# EAGLE schematic MBO (EAGLE 7.4.0)
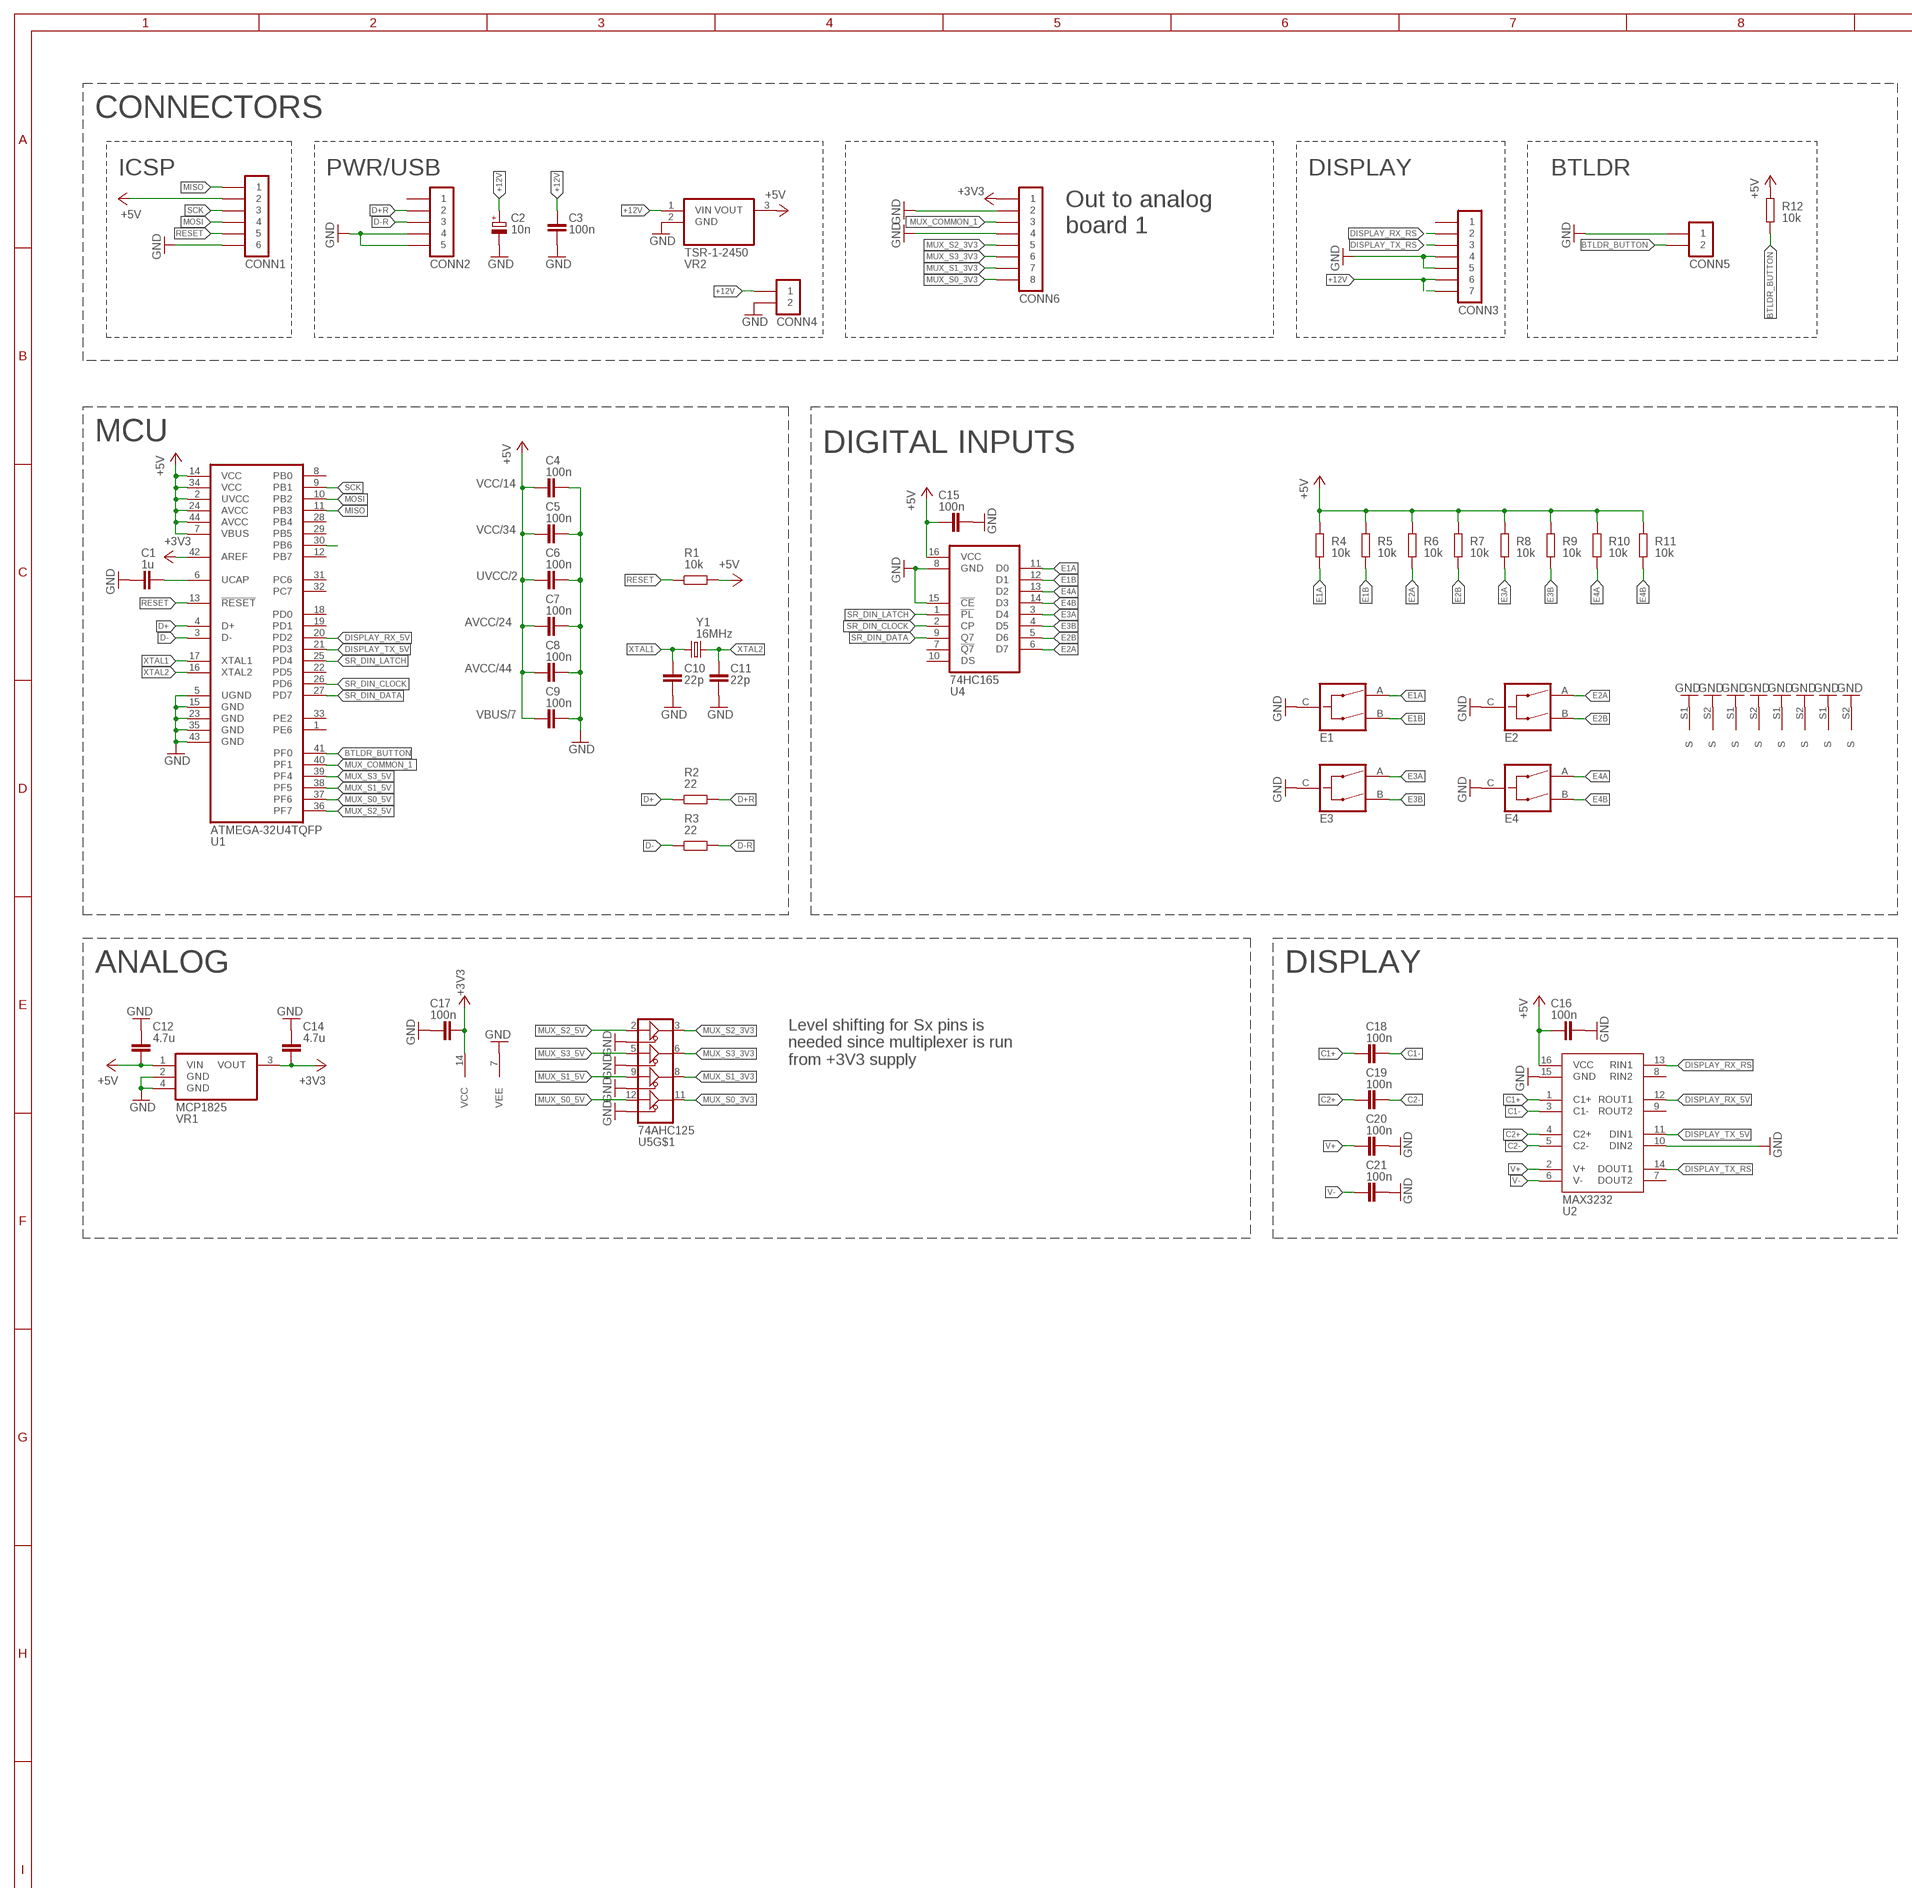
[diagram p0: schematic, sheet 1, part 1 of 2]
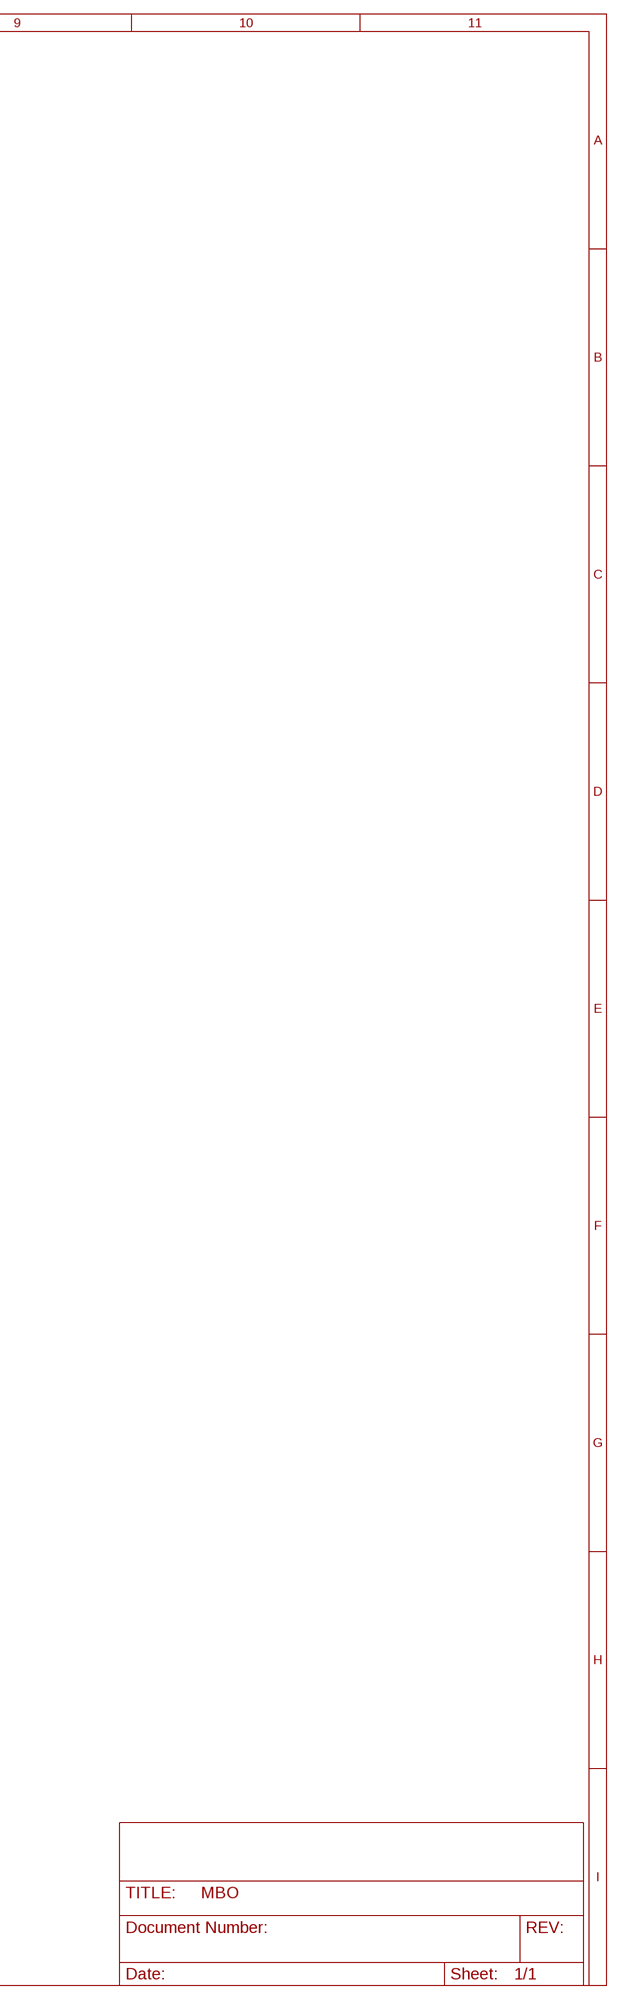
[diagram p1: schematic, sheet 1, part 2 of 2]

## Parts
C1  1u  CAPACITOR-0805  [C0805]
C2  10n  ELECTROLYTIC_CAPACITOR16V-CLV-0405  [153CLV-0405]
C3  100n  CAPACITOR-0805  [C0805]
C4  100n  CAPACITOR-0805  [C0805]
C5  100n  CAPACITOR-0805  [C0805]
C6  100n  CAPACITOR-0805  [C0805]
C7  100n  CAPACITOR-0805  [C0805]
C8  100n  CAPACITOR-0805  [C0805]
C9  100n  CAPACITOR-0805  [C0805]
C10  22p  CAPACITOR-0805  [C0805]
C11  22p  CAPACITOR-0805  [C0805]
C12  4.7u  CAPACITOR-0805  [C0805]
C14  4.7u  CAPACITOR-0805  [C0805]
C15  100n  CAPACITOR-0805  [C0805]
C16  100n  CAPACITOR-0805  [C0805]
C17  100n  CAPACITOR-0805  [C0805]
C18  100n  CAPACITOR-0805  [C0805]
C19  100n  CAPACITOR-0805  [C0805]
C20  100n  CAPACITOR-0805  [C0805]
C21  100n  CAPACITOR-0805  [C0805]
CONN1  PINHD-2X03-TH-2.54MM-V  [2X03-2.54-V]
CONN2  PINHD-1X05-JST-XH-H  [JST-XH-05P-H]
CONN3  PINHD-1X07-JST-H  [JST-XH-07P-H]
CONN4  PINHD-1X02-MOLEX-39357-0002  [MOLEX-39357-0002]
CONN5  PINHD-1X02-JST-XH-H  [JST-XH-02P-H]
CONN6  PINHD-2X04-IDC-2.54-V  [IDC-08P-2.54]
E1  ALPS-EC12E24404AX  [EC12E-1]
E2  ALPS-EC12E24404AX  [EC12E-1]
E3  ALPS-EC12E24404AX  [EC12E-1]
E4  ALPS-EC12E24404AX  [EC12E-1]
R1  10k  RESISTOR-0805  [R0805]
R2  22  RESISTOR-0805  [R0805]
R3  22  RESISTOR-0805  [R0805]
R4  10k  RESISTOR-0805  [R0805]
R5  10k  RESISTOR-0805  [R0805]
R6  10k  RESISTOR-0805  [R0805]
R7  10k  RESISTOR-0805  [R0805]
R8  10k  RESISTOR-0805  [R0805]
R9  10k  RESISTOR-0805  [R0805]
R10  10k  RESISTOR-0805  [R0805]
R11  10k  RESISTOR-0805  [R0805]
R12  10k  RESISTOR-0805  [R0805]
U1  ATMEGA-32U4TQFP  [TQFP-44]
U2  MAX3232  [SO16]
U4  74HC165  [SO16]
U5  74AHC125  [SOIC14]
VR1  MCP1825  [SOT223]
VR2  TSR-1-2450  [TSR-1-2450]
Y1  16MHz  CRYSTAL-HC49  [HC49US]

## Nets
+3V3: C14.1 C17.1 CONN6.1 U1.42(AREF) U5.14(VCC) VR1.3(VOUT)
+5V: C4.1 C5.1 C6.1 C7.1 C8.1 C9.1 C12.1 C15.2 C16.2 CONN1.2 R1.2 R4.2 R5.2 R6.2 R7.2 R8.2 R9.2 R10.2 R11.2 R12.2 U1.2(UVCC) U1.7(VBUS) U1.14(VCC) U1.24(AVCC) U1.34(VCC) U1.44(AVCC) U2.16(VCC) U4.16(VCC) VR1.1(VIN) VR2.3(VOUT)
+12V: C2.+ C3.1 CONN3.6 CONN3.7 CONN4.P$1 VR2.1(VIN)
BTLDR_BUTTON: CONN5.2 R12.1 U1.41(PF0)
C1+: C18.1 U2.1(C1+)
C1-: C18.2 U2.3(C1-)
C2+: C19.1 U2.4(C2+)
C2-: C19.2 U2.5(C2-)
D+: R2.1 U1.4(D+)
D+R: CONN2.2 R2.2
D-: R3.1 U1.3(D-)
D-R: CONN2.3 R3.2
DISPLAY_RX_5V: U1.20(PD2) U2.12(ROUT1)
DISPLAY_RX_RS: CONN3.2 U2.13(RIN1)
DISPLAY_TX_5V: U1.21(PD3) U2.11(DIN1)
DISPLAY_TX_RS: CONN3.3 U2.14(DOUT1)
E1A: E1.A R4.1 U4.11(D0)
E1B: E1.B R5.1 U4.12(D1)
E2A: E2.A R6.1 U4.6(D7)
E2B: E2.B R7.1 U4.5(D6)
E3A: E3.A R8.1 U4.3(D4)
E3B: E3.B R9.1 U4.4(D5)
E4A: E4.A R10.1 U4.13(D2)
E4B: E4.B R11.1 U4.14(D3)
GND: C1.2 C2.- C3.2 C4.2 C5.2 C6.2 C7.2 C8.2 C9.2 C10.1 C11.1 C12.2 C14.2 C15.1 C16.1 C17.2 C20.2 C21.2 CONN1.6 CONN2.4 CONN2.5 CONN3.4 CONN3.5 CONN4.P$2 CONN5.1 CONN6.2 CONN6.4 E1.C E1.S1(S) E1.S2(S) E2.C E2.S1(S) E2.S2(S) E3.C E3.S1(S) E3.S2(S) E4.C E4.S1(S) E4.S2(S) U1.5(UGND) U1.15(GND) U1.23(GND) U1.35(GND) U1.43(GND) U2.10(DIN2) U2.15(GND) U4.8(GND) U4.15(!CE) U5.1(1!(OE)) U5.4(2!(OE)) U5.7(VEE) U5.10(3!(OE)) U5.13(4!(OE)) VR1.2(GND) VR1.4(GND) VR2.2(GND)
MISO: CONN1.1 U1.11(PB3)
MOSI: CONN1.4 U1.10(PB2)
MUX_COMMON_1: CONN6.3 U1.40(PF1)
MUX_S0_3V3: CONN6.8 U5.11(4Y)
MUX_S0_5V: U1.37(PF6) U5.12(4A)
MUX_S1_3V3: CONN6.7 U5.8(3Y)
MUX_S1_5V: U1.38(PF5) U5.9(3A)
MUX_S2_3V3: CONN6.5 U5.3(1Y)
MUX_S2_5V: U1.36(PF7) U5.2(1A)
MUX_S3_3V3: CONN6.6 U5.6(2Y)
MUX_S3_5V: U1.39(PF4) U5.5(2A)
N$1: C1.1 U1.6(UCAP)
N$5: U1.30(PB6)
RESET: CONN1.5 R1.1 U1.13(!RESET)
SCK: CONN1.3 U1.9(PB1)
SR_DIN_CLOCK: U1.26(PD6) U4.2(CP)
SR_DIN_DATA: U1.27(PD7) U4.9(Q7)
SR_DIN_LATCH: U1.25(PD4) U4.1(!PL)
V+: C20.1 U2.2(V+)
V-: C21.1 U2.6(V-)
XTAL1: C10.2 U1.17(XTAL1) Y1.1
XTAL2: C11.2 U1.16(XTAL2) Y1.2
Unconnected: CONN2.1 CONN3.1 U1.1(PE6) U1.8(PB0) U1.12(PB7) U1.18(PD0) U1.19(PD1) U1.22(PD5) U1.28(PB4) U1.29(PB5) U1.31(PC6) U1.32(PC7) U1.33(PE2) U2.7(DOUT2) U2.8(RIN2) U2.9(ROUT2) U4.7(!Q7) U4.10(DS)

## Notes on the sheet
- CONNECTORS
- ICSP | PWR/USB | DISPLAY | BTLDR
- Out to analog
  board 1
- MCU
- DIGITAL INPUTS
- VCC/14
- VCC/34
- UVCC/2
- AVCC/24
- AVCC/44
- VBUS/7
- ANALOG | DISPLAY
- Level shifting for Sx pins is
  needed since multiplexer is run
  from +3V3 supply

## Library data of the parts
C1 C3-C12 C14-C21 = igor_lbr:CAPACITOR: Capacitor
C2 = igor_lbr:ELECTROLYTIC_CAPACITOR: Electrolytic capacitor; MANUFACTURER: Multicomp; MPN: MCVVT016M100CA1L
CONN1 = igor_lbr:PINHD-2X03: Pin Header
CONN2 = igor_lbr:PINHD-1X05: Pin Header
CONN3 = igor_lbr:PINHD-1X07: Pin header
CONN4 = igor_lbr:PINHD-1X02: Pin Header; MANUFACTURER: Molex; MPN: 39357-0002
CONN5 = igor_lbr:PINHD-1X02: Pin Header
CONN6 = igor_lbr:PINHD-2X04: Pin Header
E1-E4 = igor_lbr:ALPS-EC12E24404AX: ALPS encoder
R1-R12 = igor_lbr:RESISTOR: Resistor
U1 = igor_lbr:ATMEGA-32U4: 8-bit Microcontroller with 16/32 Bytes of ISP Flash and USB Controller; MPN: ATMEGA32U4-AUR
U2 = igor_lbr:MAX3232: RS-232 Line Driver/Receiver; MANUFACTURER: Texas Instruments; MPN: MAX3232CDR
U4 = igor_lbr:74*165: 8-bit parallel-in/serial out shift register; MANUFACTURER: Nexperia; MPN: 74HC165D
U5 = igor_lbr:74AHC125: Quad buffer/line driver; MANUFACTURER: Texas Instruments; MPN: SN74AHC125DR
VR1 = igor_lbr:MCP1825: 500 mA, Low Voltage, Low Quiescent Current LDO Regulator; MANUFACTURER: Microchip; MPN: MCP1825S-3302E/DB
VR2 = igor_lbr:TSR-1-2450: DC/DC Step-Down Converter; MANUFACTURER: Traco Power; MPN: TSR 1-2450
Y1 = igor_lbr:CRYSTAL: Crystal; MANUFACTURER: TXC; MPN: 9B-8.000MEEJ-B

## Net classes
0 default: width 0.203 mm
1 vcc: width 0.254 mm